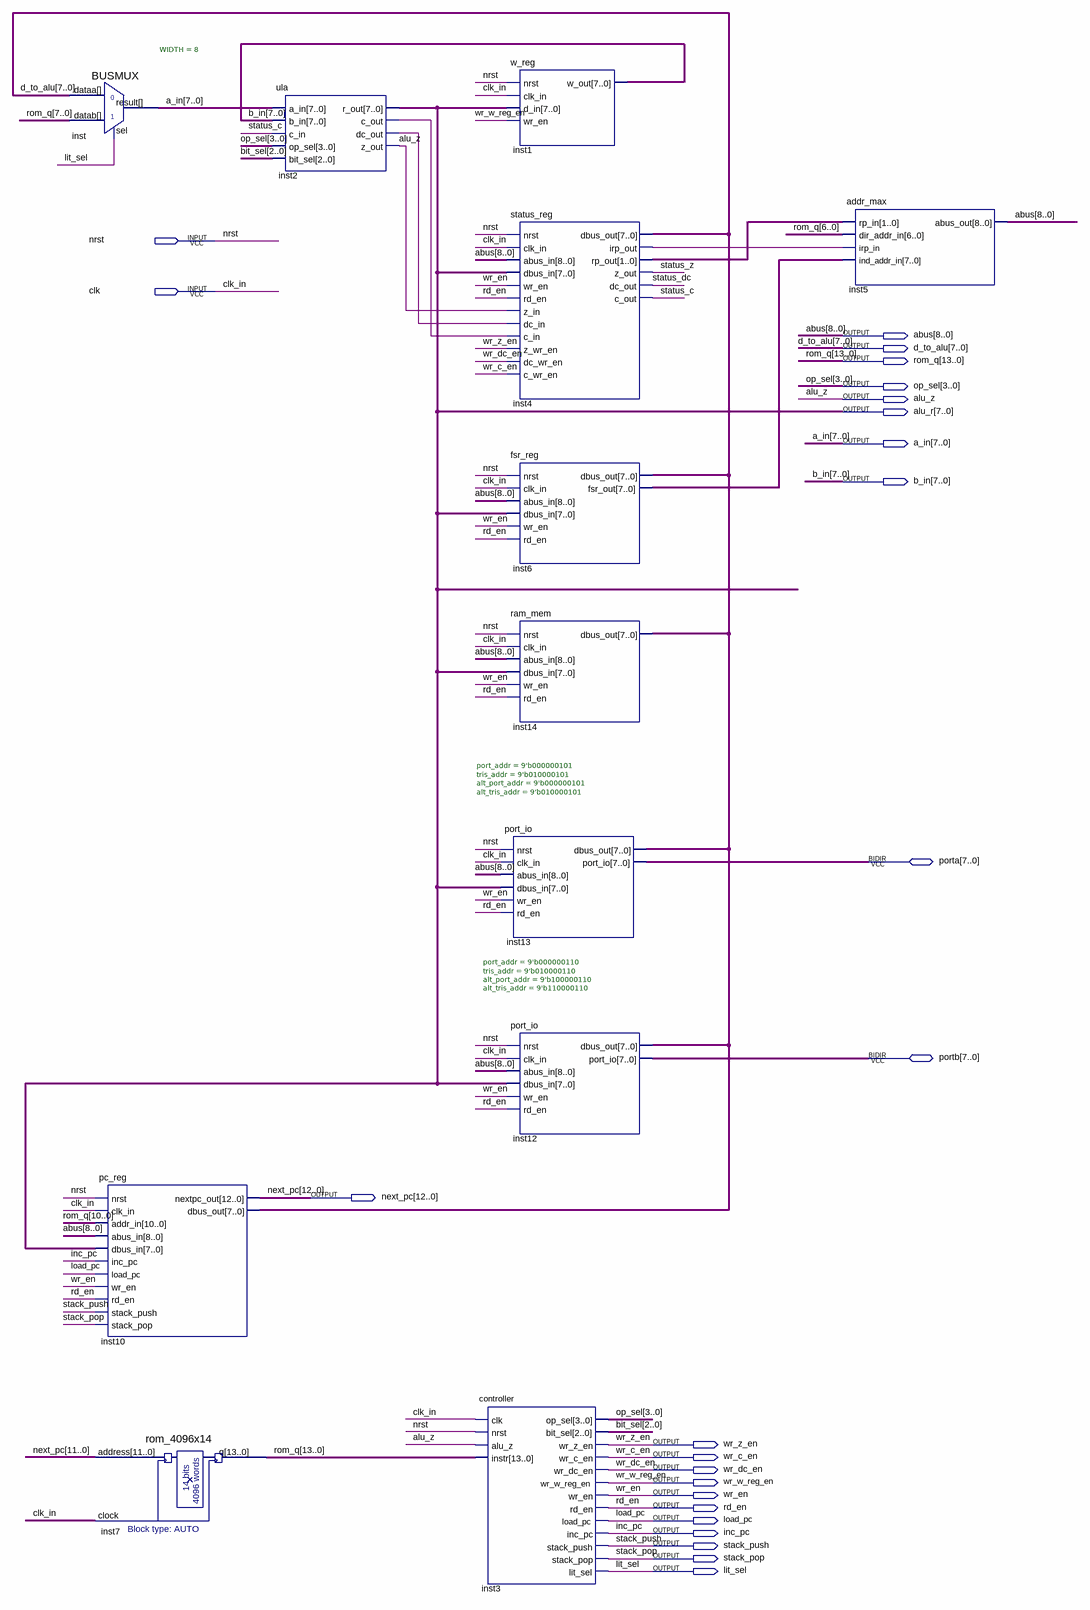
[diagram p0: schematic sheet]
// Quartus schematic PIC.bdf as structural Verilog: 12 symbols, 24 pins
module PIC (
  input  nrst,
  input  clk,
  inout  [7:0] porta,
  inout  [7:0] portb,
  output [8:0] abus,
  output [7:0] d_to_alu,
  output [13:0] rom_q,
  output [3:0] op_sel,
  output alu_z,
  output [7:0] alu_r,
  output [7:0] a_in,
  output [7:0] b_in,
  output [12:0] next_pc,
  output wr_z_en,
  output wr_c_en,
  output wr_dc_en,
  output wr_w_reg_en,
  output wr_en,
  output rd_en,
  output load_pc,
  output inc_pc,
  output stack_push,
  output stack_pop,
  output lit_sel
);

  wire inst2_c_out, inst2_dc_out, inst4_irp_out, status_c, status_dc, status_z;
  wire [1:0] inst4_rp_out;
  wire [2:0] bit_sel;
  wire [7:0] inst6_fsr_out;

  BUSMUX #(.WIDTH(8)) inst (.datab(rom_q[7:0]), .sel(lit_sel), .dataa(d_to_alu), .result(a_in));
  pc_reg inst10 (
    .nrst(nrst), .clk_in(clk), .addr_in(rom_q[10:0]), .abus_in(abus), .dbus_in(alu_r), .inc_pc(inc_pc),
    .load_pc(load_pc), .wr_en(wr_en), .rd_en(rd_en), .stack_push(stack_push), .stack_pop(stack_pop),
    .nextpc_out(next_pc), .dbus_out(d_to_alu));
  rom_4096x14 inst7 (.address(next_pc[11:0]), .clock(clk), .q(rom_q));
  ula inst2 (
    .a_in(a_in), .b_in(b_in), .c_in(status_c), .op_sel(op_sel), .bit_sel(bit_sel), .r_out(alu_r),
    .c_out(inst2_c_out), .dc_out(inst2_dc_out), .z_out(alu_z));
  w_reg inst1 (.nrst(nrst), .clk_in(clk), .d_in(alu_r), .wr_en(wr_w_reg_en), .w_out(b_in));
  status_reg inst4 (
    .nrst(nrst), .clk_in(clk), .abus_in(abus), .dbus_in(alu_r), .wr_en(wr_en), .rd_en(rd_en), .z_in(alu_z),
    .dc_in(inst2_dc_out), .c_in(inst2_c_out), .z_wr_en(wr_z_en), .dc_wr_en(wr_dc_en), .c_wr_en(wr_c_en),
    .dbus_out(d_to_alu), .irp_out(inst4_irp_out), .rp_out(inst4_rp_out), .z_out(status_z),
    .dc_out(status_dc), .c_out(status_c));
  fsr_reg inst6 (
    .nrst(nrst), .clk_in(clk), .abus_in(abus), .dbus_in(alu_r), .wr_en(wr_en), .rd_en(rd_en),
    .dbus_out(d_to_alu), .fsr_out(inst6_fsr_out));
  ram_mem inst14 (
    .nrst(nrst), .clk_in(clk), .abus_in(abus), .dbus_in(alu_r), .wr_en(wr_en), .rd_en(rd_en),
    .dbus_out(d_to_alu));
  port_io #(.port_addr(9'b000000101), .tris_addr(9'b010000101), .alt_port_addr(9'b000000101), .alt_tris_addr(9'b010000101)) inst13 (
    .nrst(nrst), .clk_in(clk), .abus_in(abus), .dbus_in(alu_r), .wr_en(wr_en), .rd_en(rd_en),
    .dbus_out(d_to_alu), .port_io(porta));
  port_io #(.port_addr(9'b000000110), .tris_addr(9'b010000110), .alt_port_addr(9'b100000110), .alt_tris_addr(9'b110000110)) inst12 (
    .nrst(nrst), .clk_in(clk), .abus_in(abus), .dbus_in(alu_r), .wr_en(wr_en), .rd_en(rd_en),
    .dbus_out(d_to_alu), .port_io(portb));
  controller inst3 (
    .clk(clk), .nrst(nrst), .alu_z(alu_z), .instr(rom_q), .op_sel(op_sel), .bit_sel(bit_sel),
    .wr_z_en(wr_z_en), .wr_c_en(wr_c_en), .wr_dc_en(wr_dc_en), .wr_w_reg_en(wr_w_reg_en), .wr_en(wr_en),
    .rd_en(rd_en), .load_pc(load_pc), .inc_pc(inc_pc), .stack_push(stack_push), .stack_pop(stack_pop),
    .lit_sel(lit_sel));
  addr_max inst5 (
    .rp_in(inst4_rp_out), .dir_addr_in(rom_q[6:0]), .irp_in(inst4_irp_out), .ind_addr_in(inst6_fsr_out),
    .abus_out(abus));

  // Other names for the same wires on the sheet: clk_in = clk
endmodule
